# Altium project OpenBeacon-Tag-BL.PrjPCB
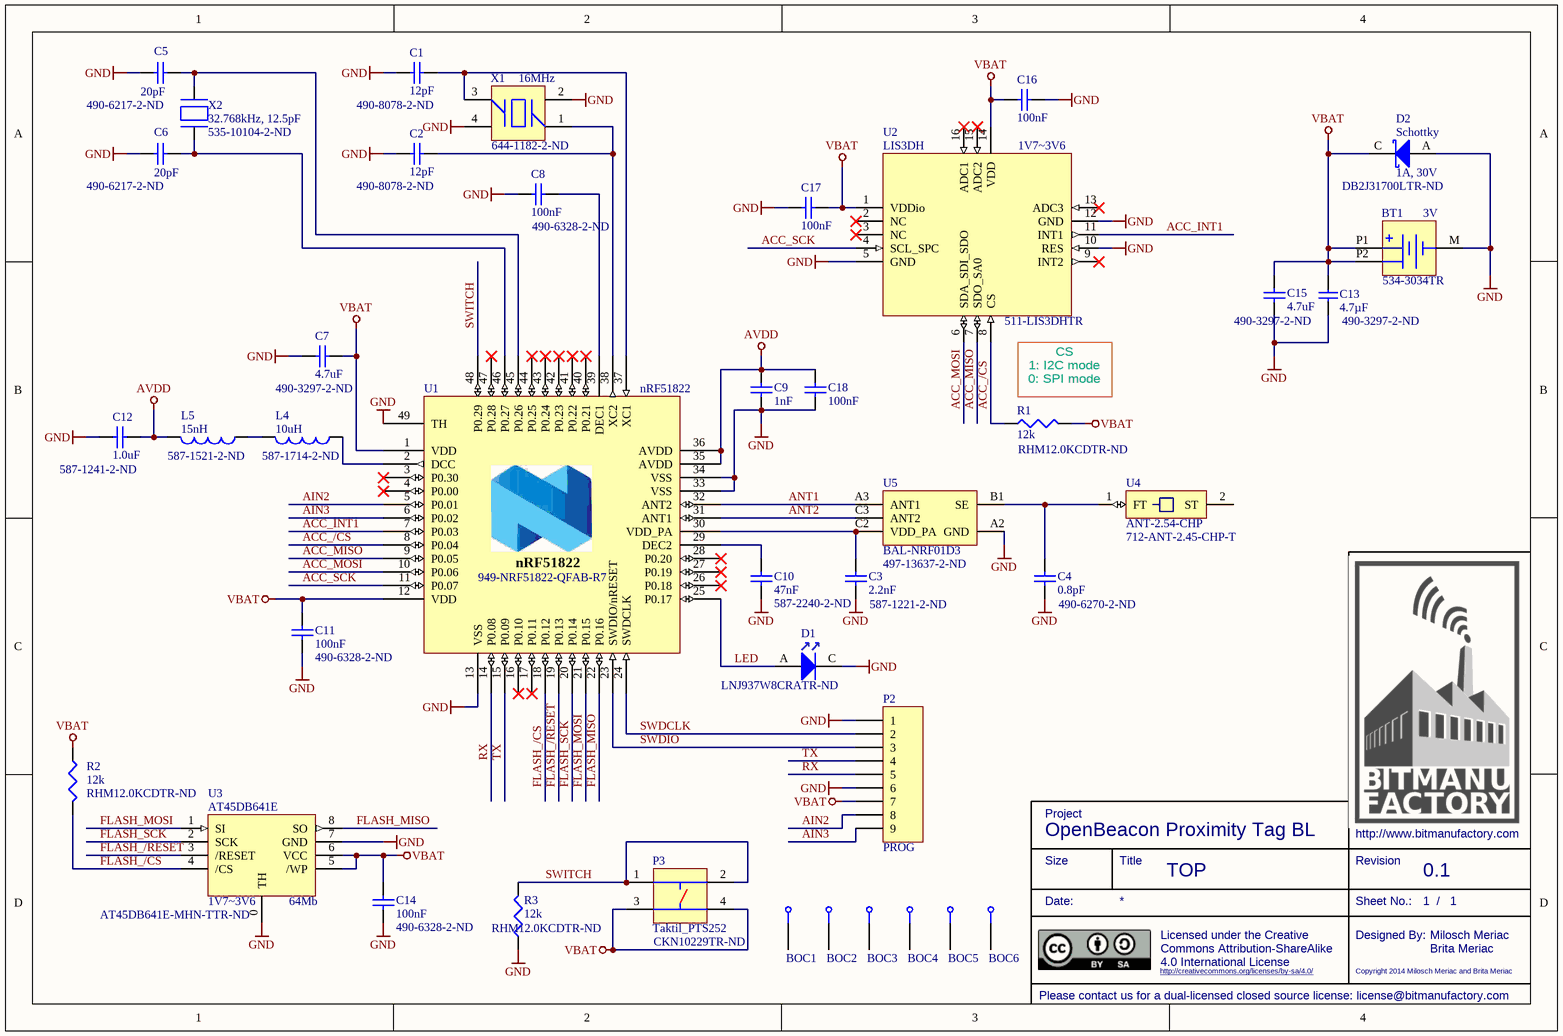
[diagram p0: OpenBeacon.SchDoc]
1 sheet, 41 parts. Net scope: global (net labels, ports and power ports of the same name join across sheets).
Board file: OpenBeacon.PcbDoc

## Sheet OpenBeacon.SchDoc: TOP
size A4; CompanyName: Bitmanufactory Ltd.; DrawnBy: Brita Meriac; Engineer: Milosch Meriac; Revision: 0.1; SheetNumber: 1; SheetTotal: 1; CompanyURL: http://www.bitmanufactory.com; Project: OpenBeacon Proximity Tag BL

### Parts
BOC1  Testpad  [TESTPAD_1MM]  (value not drawn)
BOC2  Testpad  [TESTPAD_1MM]  (value not drawn)
BOC3  Testpad  [TESTPAD_1MM]  (value not drawn)
BOC4  Testpad  [TESTPAD_1MM]  (value not drawn)
BOC5  Testpad  [TESTPAD_1MM]  (value not drawn)
BOC6  Testpad  [TESTPAD_1MM]  (value not drawn)
BT1  value 3V  Supplier Part Number 1: 534-3034TR  [BAT-Holder_3034]  (hidden comment: Battery Cell Holder)
C1  Supplier Part Number 1: 490-8078-2-ND  [0402[1005]]  (hidden comment: 12pF)
C2  Supplier Part Number 1: 490-8078-2-ND  [0402[1005]]  (hidden comment: 12pF)
C3  Supplier Part Number 1: 587-1221-2-ND  [0402[1005]]  (hidden comment: 2.2nF)
C4  Supplier Part Number 1: 490-6270-2-ND  [0402[1005]]  (hidden comment: 0.8pF)
C5  value 20pF  Supplier Part Number 1: 490-6217-2-ND  [0402[1005]]  (hidden comment: Cap 20pF)
C6  value 20pF  Supplier Part Number 1: 490-6217-2-ND  [0402[1005]]  (hidden comment: Cap 20pF)
C7  Supplier Part Number 1: 490-3297-2-ND  [0603[1608]_a]  (hidden comment: 4.7uF)
C8  Supplier Part Number 1: 490-6328-2-ND  [0402[1005]]  (hidden comment: 100nF)
C9  1nF  [0402[1005]]
C10  Supplier Part Number 1: 587-2240-2-ND  [0402[1005]]  (hidden comment: 47nF)
C11  Supplier Part Number 1: 490-6328-2-ND  [0402[1005]]  (hidden comment: 100nF)
C12  Supplier Part Number 1: 587-1241-2-ND  [0603[1608]_a]  (hidden comment: 1.0uF)
C13  4.7µF  Supplier Part Number 1: 490-3297-2-ND  [0603[1608]_a]
C14  Supplier Part Number 1: 490-6328-2-ND  [0402[1005]]  (hidden comment: 100nF)
C15  Supplier Part Number 1: 490-3297-2-ND  [0603[1608]_a]  (hidden comment: 4.7uF)
C16  100nF  [0402[1005]]
C17  100nF  [0402[1005]]
C18  100nF  [0402[1005]]
D1  Supplier Part Number 1: LNJ937W8CRATR-ND  [LED_0603]  (hidden comment: LED blue)
D2  Schottky  value 1A, 30V  Supplier Part Number 1: DB2J31700LTR-ND  [SC-90A]
L4  Supplier Part Number 1: 587-1714-2-ND  [0603[1608]_a]  (hidden comment: 10uH)
L5  Supplier Part Number 1: 587-1521-2-ND  [0402[1005]]  (hidden comment: 15nH)
P2  PROG  [HDR1X9_round_custom-SMD]
P3  Taktil_PTS252  Supplier Part Number 1: CKN10229TR-ND  [taktil_PTS525]
R1  Supplier Part Number 1: RHM12.0KCDTR-ND  [0402[1005]]  (hidden comment: 12k)
R2  Supplier Part Number 1: RHM12.0KCDTR-ND  [0402[1005]]  (hidden comment: 12k)
R3  Supplier Part Number 1: RHM12.0KCDTR-ND  [0402[1005]]  (hidden comment: 12k)
U1  nRF51822  Supplier Part Number 1: 949-NRF51822-QFAB-R7  [QFN-48]
U2  LIS3DH  supply voltage: 1V7~3V6  Supplier Part Number 1: 511-LIS3DHTR  [LGA-16]
U3  AT45DB641E  value 64Mb  supply voltage: 1V7~3V6  Supplier Part Number 1: AT45DB641E-MHN-TTR-ND  [UDFN-8MA1]
U4  ANT-2.54-CHP  Supplier Part Number 1: 712-ANT-2.45-CHP-T  [ANT-CHP_rainsun]
U5  BAL-NRF01D3  Supplier Part Number 1: 497-13637-2-ND  [BAL-NRF01D3]
X1  value 16MHz  Supplier Part Number 1: 644-1182-2-ND  [SMD3225]  (hidden comment: XTAL_4Pin)
X2  value 32.768kHz, 12.5pF  Supplier Part Number 1: 535-10104-2-ND  [ABS06]  (hidden comment: XTAL-2pin)

### Nets
AVDD: C9.1 C12.1 C18.1 L5.2 U1.35(AVDD) U1.36(AVDD)
GND: BT1.M C1.2 C2.2 C3.2 C4.2 C5.1 C6.1 C7.2 C8.2 C9.2 C10.2 C11.2 C12.2 C13.1 C14.2 C15.2 C16.1 C17.2 C18.2 D1.C(Cathode) D2.A(Anode) P2.1 P2.6 R3.2 U1.13(VSS) U1.33(VSS) U1.34(VSS) U1.49(TH) U2.5(GND) U2.10(RES) U2.12(GND) U3.0(TH) U3.7(GND) U5.A2(GND) X1.2 X1.4
VBAT: BT1.P1 BT1.P2 C7.1 C11.1 C13.2 C14.1 C15.1 C16.2 C17.1 D2.C(Cathode) P2.7 P3.3 P3.4 R1.2 R2.1 U1.1(VDD) U1.12(VDD) U2.1(VDDio) U2.14(VDD) U3.5(/WP) U3.6(VCC)
ACC_/CS: R1.1 U1.8(P0.04) U2.8(CS)
ACC_INT1: U1.7(P0.03) U2.11(INT1)
ACC_MISO: U1.9(P0.05) U2.7(SDO_SA0)
ACC_MOSI: U1.10(P0.06) U2.6(SDA_SDI_SDO)
ACC_SCK: U1.11(P0.07) U2.4(SCL_SPC)
AIN2: P2.8 U1.5(P0.01)
AIN3: P2.9 U1.6(P0.02)
ANT1: U1.32(ANT2) U5.A3(ANT1)
ANT2: U1.31(ANT1) U5.C3(ANT2)
FLASH_/CS: R2.2 U1.18(P0.12) U3.4(/CS)
FLASH_/RESET: U1.19(P0.13) U3.3(/RESET)
FLASH_MISO: U1.22(P0.16) U3.8(SO)
FLASH_MOSI: U1.21(P0.15) U3.1(SI)
FLASH_SCK: U1.20(P0.14) U3.2(SCK)
LED: D1.A(Anode) U1.25(P0.17)
RX: P2.5 U1.14(P0.08)
SWDCLK: P2.2 U1.24(SWDCLK)
SWDIO: P2.3 U1.23(SWDIO/nRESET)
SWITCH: P3.1 P3.2 R3.1 U1.48(P0.29)
TX: P2.4 U1.15(P0.09)
NetC1_1: C1.1 U1.37(XC1) X1.3
NetC2_1: C2.1 U1.38(XC2) X1.1
NetC3_1: C3.1 U1.30(VDD_PA) U5.C2(VDD_PA)
NetC4_1: C4.1 U4.1(FT) U5.B1(SE)
NetC5_2: C5.2 U1.45(P0.26) X2.2
NetC6_2: C6.2 U1.46(P0.27) X2.1
NetC8_1: C8.1 U1.39(DEC1)
NetC10_1: C10.1 U1.29(DEC2)
NetL4_1: L4.1 U1.2(DCC)
NetL4_2: L4.2 L5.1

Not connected (* = marked no-connect by the designer): BOC1 1; BOC2 1; BOC3 1; BOC4 1; BOC5 1; BOC6 1; U1 3(P0.30)* 4(P0.00)* 16(P0.10)* 17(P0.11)* 26(P0.18)* 27(P0.19)* 28(P0.20)* 40(P0.21)* 41(P0.22)* 42(P0.23)* 43(P0.24)* 44(P0.25)* 47(P0.28)*; U2 2(NC)* 3(NC)* 9(INT2)* 13(ADC3)* 15(ADC2)* 16(ADC1)*; U4 2(ST)

### Notes on the sheet
- CS
  1: I2C mode
  0: SPI mode
- Project
- Date:
- Size
- Title
- Sheet No.:
- Revision
- /
- Licensed under the Creative Commons Attribution-ShareAlike 4.0 International License
- http://creativecommons.org/licenses/by-sa/4.0/
- Designed By:
- Copyright 2014 Milosch Meriac and Brita Meriac
- Please contact us for a dual-licensed closed source license: license@bitmanufactory.com

### Library data of the parts
BT1 = Battery_Cell: Battery Cell; note: Keystone 3034; Supplier 1: Mouser
C1 C2 = Cap Semi: Capacitor (Semiconductor SIM Model); tolerance: 2%, NPO; note: 50V; value: 12pF; Supplier 1: Digi-Key
C3 C9 = Cap Semi: Capacitor (Semiconductor SIM Model); tolerance: X7R, ±10%; note: 50V; Supplier 1: Digi-Key
  C3: value: 2.2nF
  C9: value: 1nF; Supplier Part Number 1: 490-1303-2-ND
C4 = Cap Semi: Capacitor (Semiconductor SIM Model); tolerance: NP0, ±5%; note: 50V; value: 0.8pF; Supplier 1: Digi-Key
C5 C6 = Cap Semi: Capacitor (Semiconductor SIM Model); Supplier 1: Digi-Key
C7 C15 = Cap Semi: Capacitor (Semiconductor SIM Model); tolerance: X5R, ±10%; note: 6V3; value: 4.7uF; Supplier 1: Digi-Key
C8 C11 C12 C14 C16-C18 = Cap Semi: Capacitor (Semiconductor SIM Model); tolerance: 10%, X7R; note: 16V; Supplier 1: Digi-Key
  C8 C11 C14: value: 100nF
  C12: value: 1.0uF
  C16-C18: value: 100nF; Supplier Part Number 1: 490-6328-2-ND
C10 = Cap Semi: Capacitor (Semiconductor SIM Model); tolerance: X7R, ±10%; note: 25V; value: 47nF; Supplier 1: Digi-Key
C13 = C0603-4µ7: Capacitor, X5R, ±10%; Note: 6.3V; Artikkelnr Noca: 20069060; Part Number: C0603-4µ7; Manufacturer: *; Manufacturer Part Number: *; Datasheet: *; Footprint: 0603; LatestRevisionDate: 2009-11-23; Pin Count: 2; Publisher: Nordic Semiconductor; Published: 2009-05-08; Value: 4.7µF; Supplier: *; Supplier part number: *; 2nd source Supplier: *; 2nd source part number: *; Supplier 1: Digi-Key
D1 = LED: value: 20mA; note: BLUE; Supplier 1: Digi-Key
D2 = Diode_Shottky: Schottky barrier diode; Supplier 1: Digi-Key
L4 = COIL: Inductor / Spule; tolerance: 10%; note: I_DC-min=80mA; Value: 10uH; Supplier 1: Digi-Key
L5 = COIL: Inductor / Spule; tolerance: 5%; note: I_DC-min=320mA; Value: 15nH; Supplier 1: Digi-Key
P2 = Header 9: Header, 9-Pin
P3 = Taktil_PTS252: Taster; Supplier 1: Digi-Key
R1-R3 = Res: Resistor; tolerance: 1%; note: 0.063W; Value: 12k; Supplier 1: Digi-Key
U2 = LIS3DH: LIS3DH, MEMS digital output motion sensor; Supplier 1: Mouser
U3 = AT45DB641E: serial interface Flash memory (1.7V-3.6V); Supplier 1: Digi-Key
U4 = ANT-CHP: ANT-2.54-CHP, 2.45GHz Ultra-Compact Chip Antenna; Supplier 1: Mouser
U5 = BAL-NRF01D3: ST BAL-NRF01D31; note: BAL-NRF01D3; Supplier 1: Digi-Key
X1 = XTAL_4Pin: ABM8 ceramic crystal; Supplier 1: Digi-Key
X2 = XTAL_2Pin: Crystal; Supplier 1: Digi-Key
U1 = nRF51822: Supplier 1: Mouser

## Assembly variants
Assembly Bm200_1: not fitted BOC1 BOC2 BOC3 BOC4 BOC5 BOC6